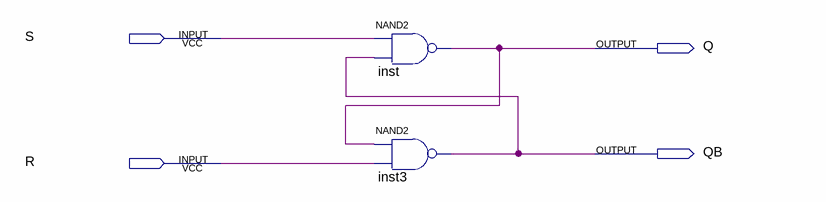
[diagram p0: schematic sheet]
// Quartus schematic RS-trigger.bdf as structural Verilog: 2 symbols, 4 pins
module \RS-trigger  (
  input  S,
  input  R,
  output Q,
  output QB
);

  nand inst (Q, S, QB);
  nand inst3 (QB, Q, R);
endmodule
